# Altium project FFrpoj.PrjPcb
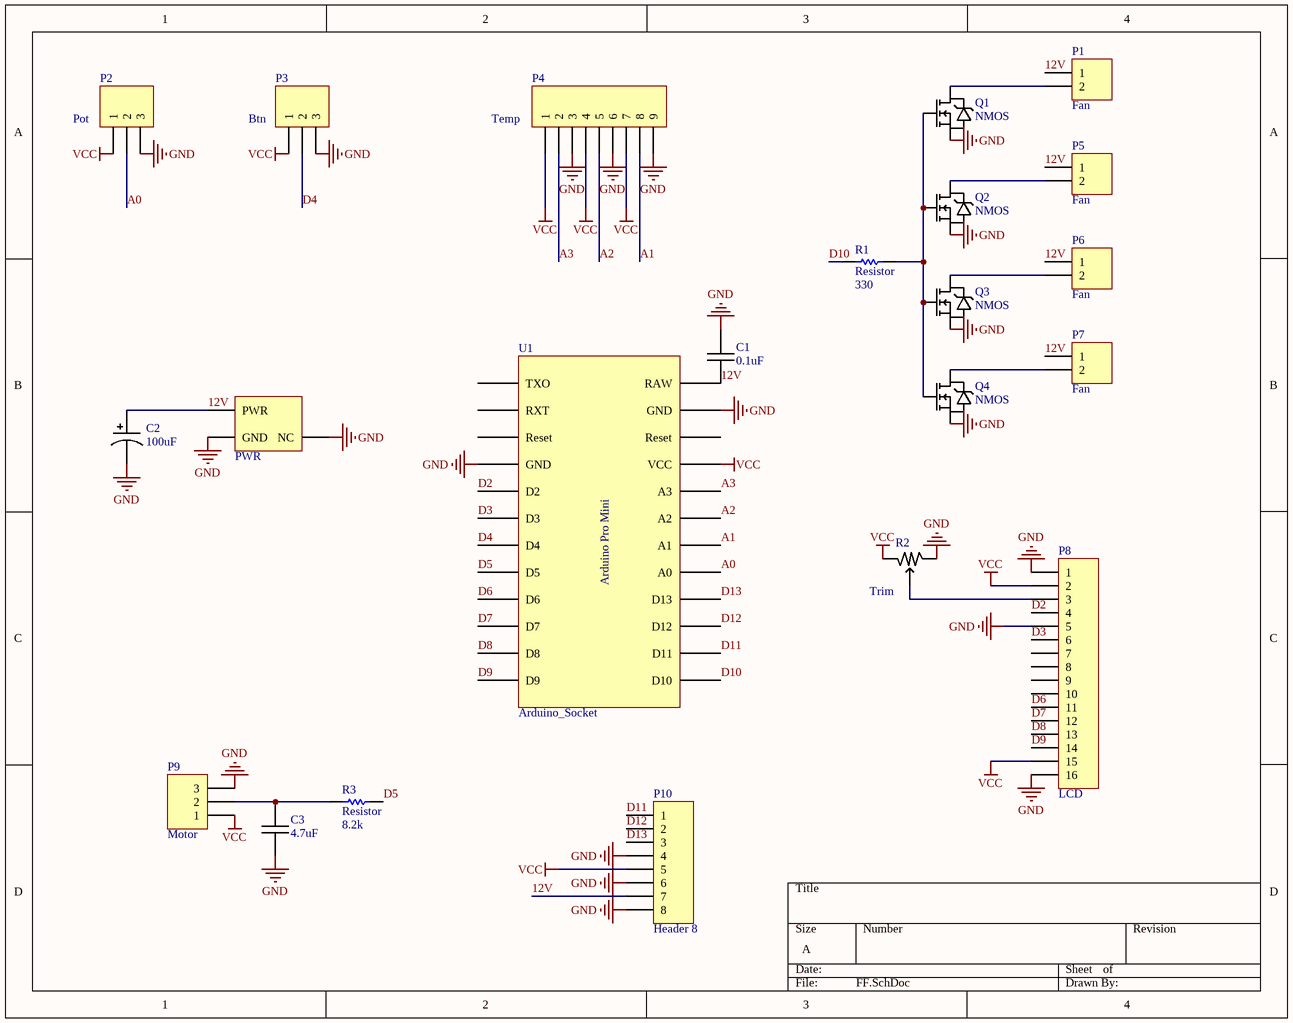
[diagram p0: FF.SchDoc]
1 sheet, 22 parts. Net scope: global (net labels, ports and power ports of the same name join across sheets).
Board file: FF.PcbDoc

## Sheet FF.SchDoc
size A

### Parts
C1  Capacitor  [Cap Axial]  (value not drawn)
C2  Capacitor  [Cap Radial-Can 200]  (value not drawn)
C3  Capacitor  [Cap Axial]  (value not drawn)
P1  Fan  [HDR1X2]
P2  Pot  [HDR1X3]
P3  Btn  [HDR1X3]
P4  Temp  [HDR1X9]
P5  Fan  [HDR1X2]
P6  Fan  [HDR1X2]
P7  Fan  [HDR1X2]
P8  LCD  [HDR1X16]
P9  Motor  [HDR1X3]
P10  Header 8  [HDR1X8]
PWR  3.5mm Power Jack  [3.5mm Power Jack]  (value not drawn)
Q1  NMOS  [TO-220]
Q2  NMOS  [TO-220]
Q3  NMOS  [TO-220]
Q4  NMOS  [TO-220]
R1  Resistor  value 330  [Res Axial 1/2W]
R2  Trimmer Pot  [T73YP103KT20]  (value not drawn)
R3  Resistor  value 8.2k  [Res Axial 1/2W]
U1  Arduino_Socket  [Arduino_Socket]

### Nets
GND: C1.1 C2.1 C3.0 P2.3 P3.3 P4.3 P4.6 P4.9 P8.1 P8.5 P8.16 P9.3 P10.4 P10.6 P10.8 PWR.2(GND) PWR.3(NC) Q1.3 Q2.3 Q3.3 Q4.3 R2.1 U1.4(GND) U1.23(GND)
VCC: P2.1 P3.1 P4.1 P4.4 P4.7 P8.2 P8.15 P9.1 P10.5 R2.0 U1.21(VCC)
12V: C1.0 C2.0 P1.1 P5.1 P6.1 P7.1 P10.7 PWR.1(PWR) U1.24(RAW)
A0: P2.2 U1.17(A0)
A1: P4.8 U1.18(A1)
A2: P4.5 U1.19(A2)
A3: P4.2 U1.20(A3)
D2: P8.4 U1.5(D2)
D3: P8.6 U1.6(D3)
D4: P3.2 U1.7(D4)
D5: R3.1 U1.8(D5)
D6: P8.11 U1.9(D6)
D7: P8.12 U1.10(D7)
D8: P8.13 U1.11(D8)
D9: P8.14 U1.12(D9)
D10: R1.1 U1.13(D10)
D11: P10.1 U1.14(D11)
D12: P10.2 U1.15(D12)
D13: P10.3 U1.16(D13)
NetC3_1: C3.1 P9.2 R3.2
NetP1_2: P1.2 Q1.2
NetP5_2: P5.2 Q2.2
NetP6_2: P6.2 Q3.2
NetP7_2: P7.2 Q4.2
NetP8_3: P8.3 R2.2
NetQ1_1: Q1.1 Q2.1 Q3.1 Q4.1 R1.2

Not connected (* = marked no-connect by the designer): P8 7 8 9 10; U1 1(TXO) 2(RXT) 3(Reset) 22(Reset)

### Notes on the sheet
- (in symbol Arduino_Socket) Arduino Pro Mini
- (in symbol Capacitor) 4.7uF; 0.1uF
- (in symbol Capacitor Polar) 100uF
- (in symbol Trimmer Pot) Trim

### Library data of the parts
C1 C3 = Capacitor: Ceramic Capacitor
C2 = Capacitor Polar: Electrolytic Capacitor
P1 P5-P7 = Header 2: Header, 2-Pin; LatestRevisionDate: 17-Jul-2002; LatestRevisionNote: Re-released for DXP Platform.; Publisher: Altium Limited
P2 P3 P9 = Header 3: Header, 3-Pin; LatestRevisionDate: 17-Jul-2002; LatestRevisionNote: Re-released for DXP Platform.; Publisher: Altium Limited
P4 = Header 9: Header, 9-Pin; LatestRevisionDate: 17-Jul-2002; LatestRevisionNote: Re-released for DXP Platform.; Publisher: Altium Limited
P8 = Header 16: Header, 16-Pin; LatestRevisionDate: 17-Jul-2002; LatestRevisionNote: Re-released for DXP Platform.; Publisher: Altium Limited
P10 = Header 8: Header, 8-Pin; LatestRevisionDate: 17-Jul-2002; LatestRevisionNote: Re-released for DXP Platform.; Publisher: Altium Limited
R1 R3 = Resistor: Published: 8-Jun-2000; LatestRevisionDate: 17-Jul-2002; LatestRevisionNote: Re-released for DXP Platform.; PackageReference: AXIAL-0.3; Publisher: Altium Limited; PackageDescription: Axial Device, Thru-Hole; 2 Leads; 0.3 in Pin Spacing